# EAGLE design OptoEndSwitch (EAGLE 9.6.2)
CNAME: https://github.com/thomo/anycubic-i3-mega.git; CREVISION: v1.0; DESIGNER: ThoMo
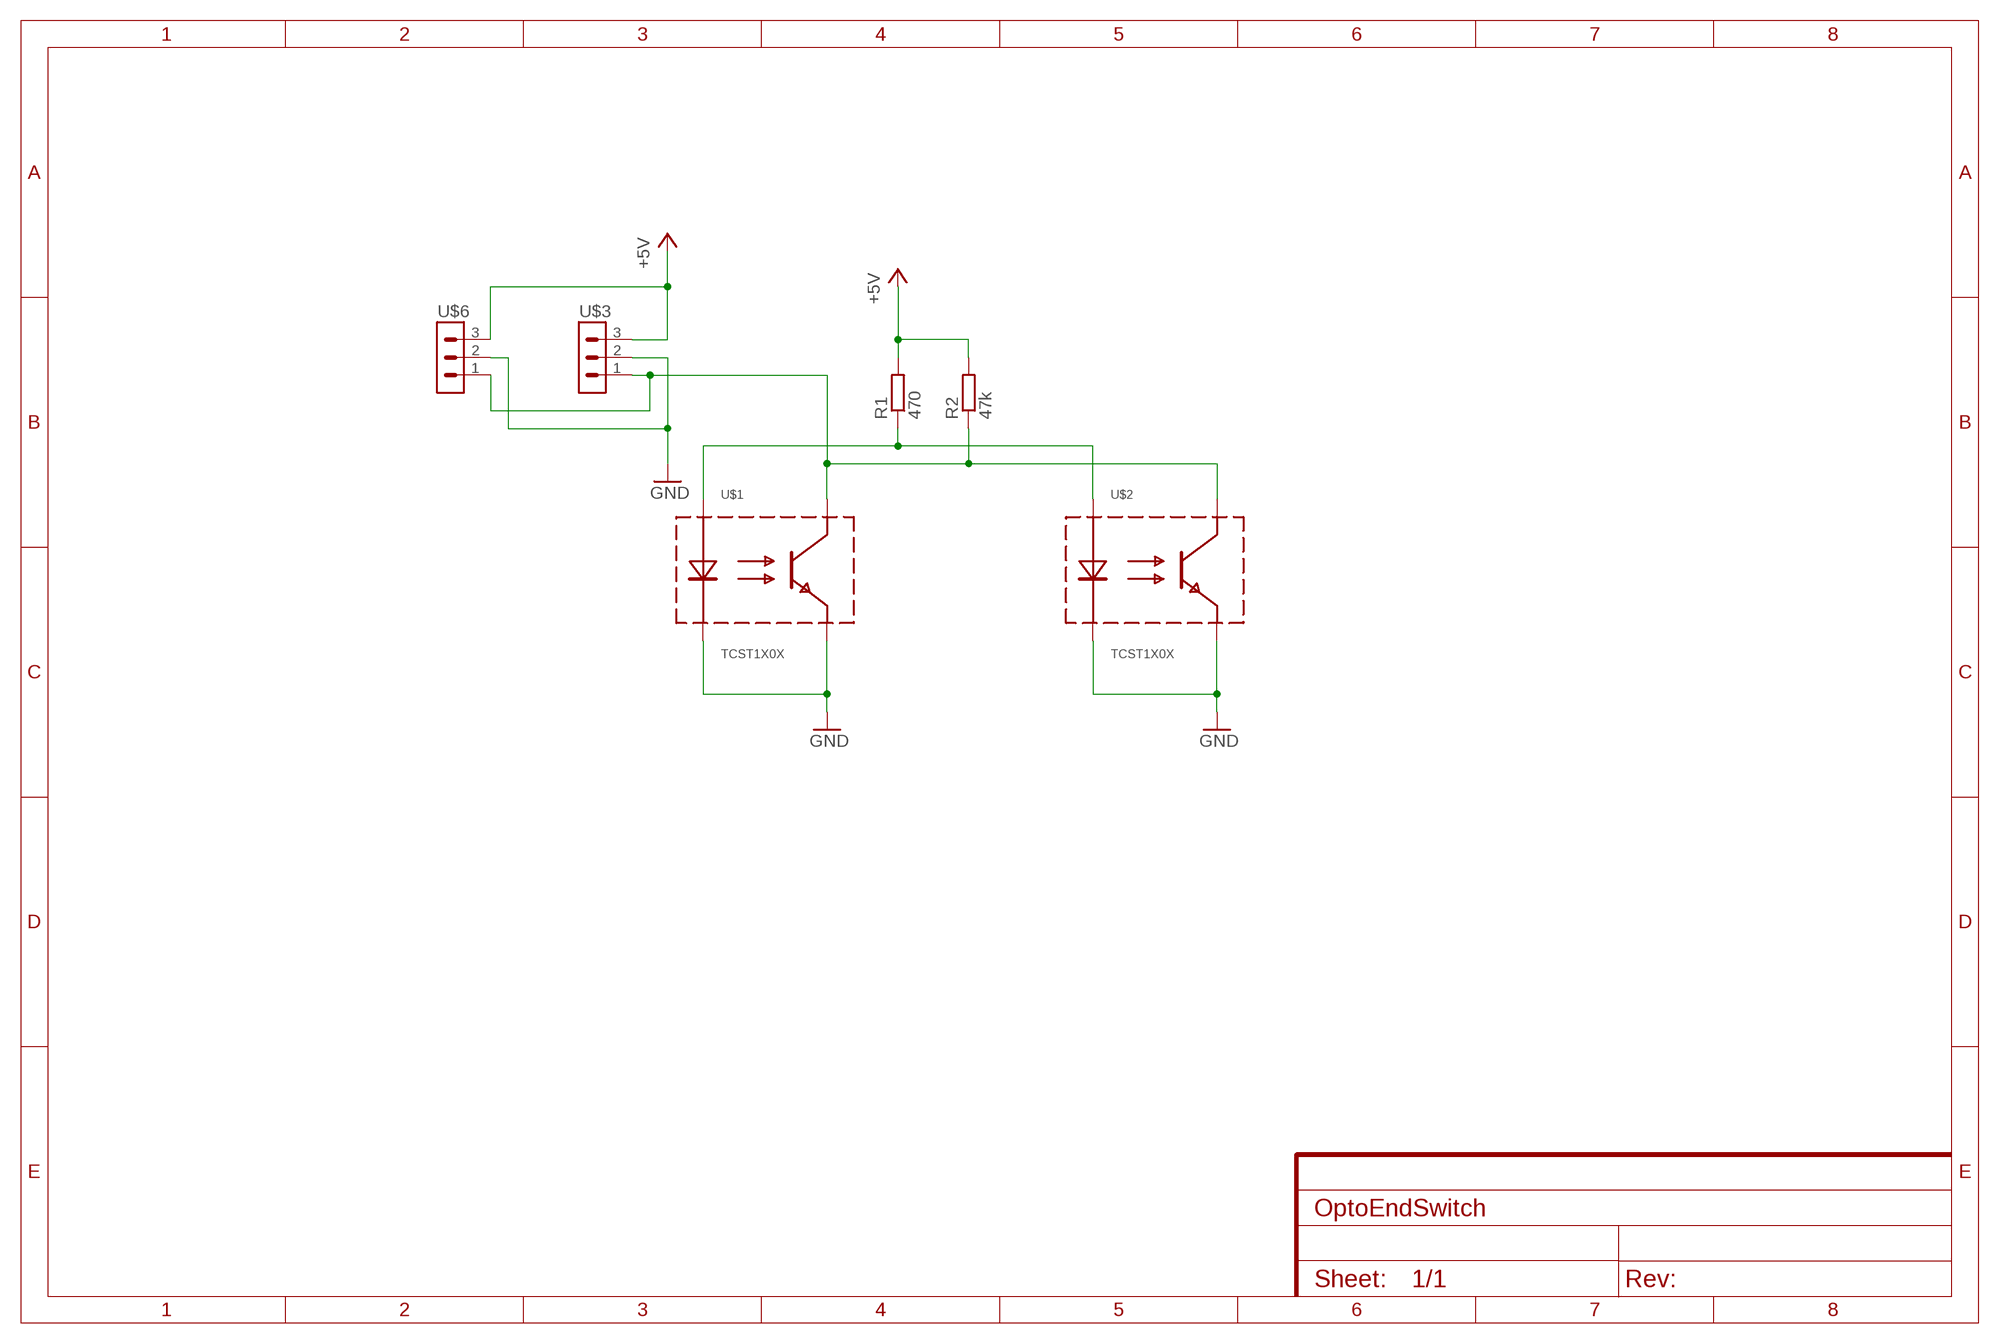
[diagram p0: schematic, sheet 1]

## Parts
R1  470  R-EU_0207/10  [0207/10]
R2  47k  R-EU_0207/10  [0207/10]
U$1  TCST1X0X  [TCST1X0X]
U$2  TCST1X0X  [TCST1X0X]
U$3  JST-3PSIDE-SHORT  [XH-A-1-SIDE-3P]
U$6  JST-3PSIDE-SHORT  [XH-A-1-SIDE-3P]

## Nets
+5V: R1.2 R2.2 U$3.3 U$6.3
GND: U$1.D U$1.E U$2.D U$2.E U$3.2 U$6.2
N$3: R2.1 U$1.D+ U$2.D+ U$3.1 U$6.1
N$4: R1.1 U$1.E+ U$2.E+

## Library data of the parts
R1 R2 = rcl:R-EU_: RESISTOR, European symbol; SPICEPREFIX: R
U$1 U$2 = thomo-opto:TCST1X0X: VISHAY TCST1103, TCST1202, TCST1300 Transmissive Optical Sensor with Phototransistor Output Datasheet <https://www.vishay.com/docs/83764/tcst1103.pdf>
U$3 U$6 = thomo-jst:JST-3P: 3 pin JST connector

## Board
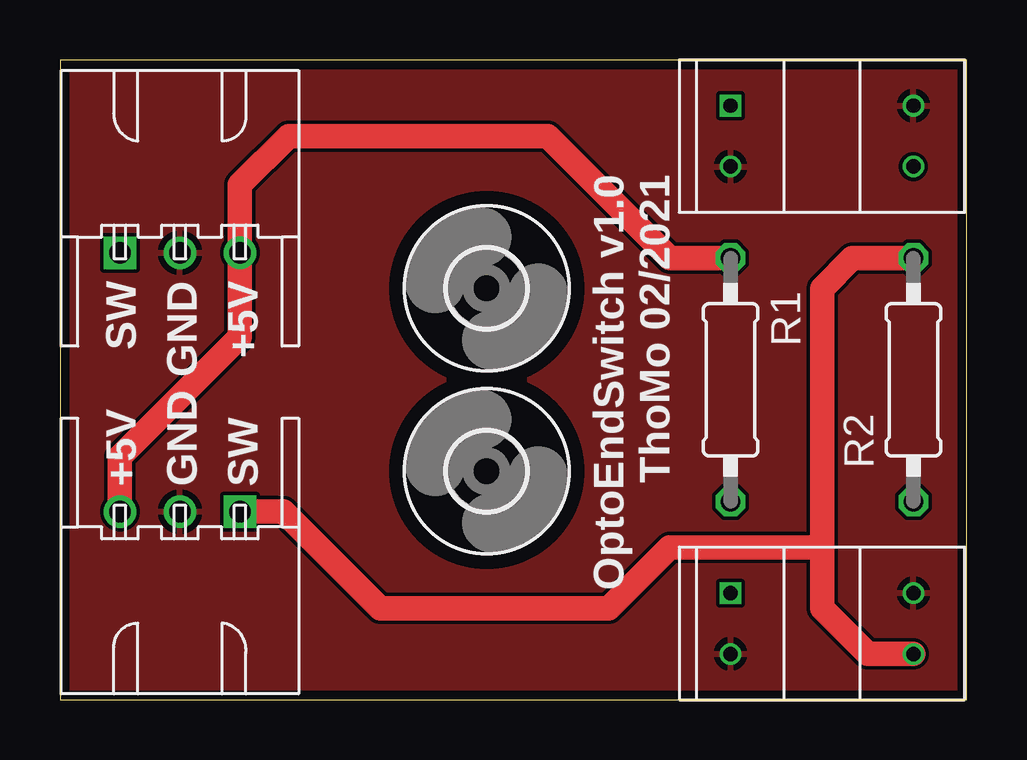
[diagram p1: board, top side]
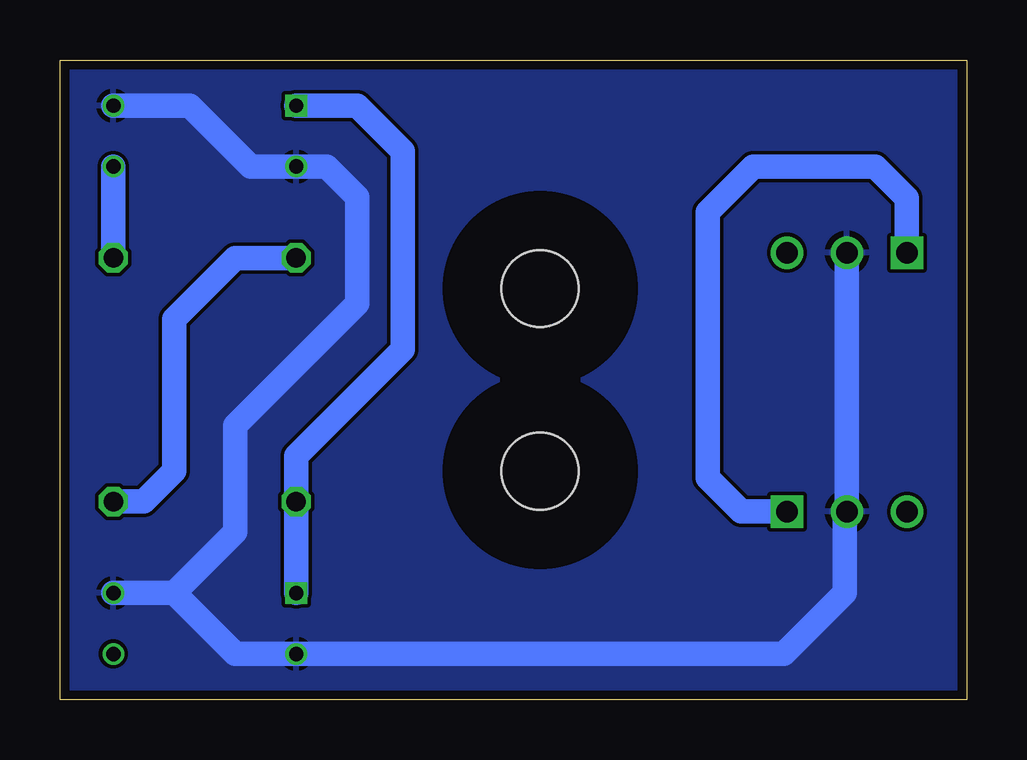
[diagram p2: board, bottom side, seen from below]

Size 37.78 x 26.67 mm. Coordinates in mm from the lower left corner, seen from the top.
Outline: 0,26.67 0,0 37.78,0 37.78,26.67 0,26.67
Copper layers (1*16): Top 0.035559375mm / dielectric 1.6mm / Bottom 0.035559375mm
Design rules "oshpark-2layer": minimum track width 6mil, minimum drill 10mil, track to track 6mil, track to pad 6mil, pad to pad 6mil, via to via 6mil, smd to smd 6mil, copper to edge 15mil, drill to drill 6mil, minimum pad ring 5mil, minimum via ring 5mil, stop-mask expansion 2.5mil, vias tented up to drill 0mil, thermal gap 10mil

### Footprints (pad centres in the part's own frame; a part is rotated, then mirrored left to right if it is on the bottom)
0207/10 = drill 0.813 octagon: 1 -5.08,0; 2 5.08,0
TCST1X0X = drill 0.6: D 3.81,1.27; D+ 3.81,-1.27; E -3.81,-1.27 | drill 0.6 square: E+ -3.81,1.27
XH-A-1-SIDE-3P = drill 0.9 square: 1 0,0 | drill 0.9: 2 2.5,0; 3 5,0
3,2 = hole 3.2: 0,0

### Placement (x,y rotation side)
R1  27.94,13.34 90 top
R2  35.56,13.34 270 top
U$1  31.75,3.17 0 top
U$2  31.75,23.5 0 top
U$3  7.49,7.84 180 top
U$4  [3,2]  17.78,17.14 270 top
U$5  [3,2]  17.78,9.53 270 top
U$6  2.5,18.64 0 top

### Tracks (layer width: path | path; a pad name or v marks a point on that pad's centre or on a via)
+5V
  Top 1.016: U$3.3 2.5,10.12 7.5,15.12 U$6.3 7.5,21.46 9.53,23.5 20.32,23.5 25.4,18.41 R1.2
  Bottom 1.016: R1.2 30.48,18.41 33.02,15.88 33.02,9.53 34.29,8.26 R2.2
GND
  Bottom 1.016: U$6.2 U$3.2 | U$3.2 | U$2.D 32.38,24.77 29.84,22.23 U$2.E 26.67,22.23 25.4,20.95 25.4,16.51 30.48,11.43 30.48,6.99 33.02,4.45 | 33.02,4.45 30.48,1.91 U$1.E 7.62,1.91 5.08,4.45 5.08,7.76 U$3.2 | U$1.D 33.02,4.45
  pour Top: 0,26.67 37.78,26.67 37.78,0 0,0
  pour Bottom: 0,26.67 37.78,26.67 37.78,0 0,0
N$3
  Top 1.016: U$1.D+ 33.66,1.91 31.75,3.81 31.75,6.35 | 31.75,6.35 31.75,17.14 33.02,18.41 R2.1 | U$3.1 9.3,7.84 13.34,3.81 22.86,3.81 25.4,6.35 31.75,6.35
  Bottom 1.016: U$6.1 2.5,20.91 3.81,22.23 8.89,22.23 10.79,20.32 10.79,9.24 9.4,7.84 U$3.1 | R2.1 U$2.D+
N$4
  Bottom 1.016: U$2.E+ 25.4,24.77 23.5,22.86 23.5,14.61 27.94,10.16 R1.1 U$1.E+

### Text on the board
tPlace: OptoEndSwitch v1.0 / ThoMo 02/2021 | SW | GND | +5V | +5V | GND | SW